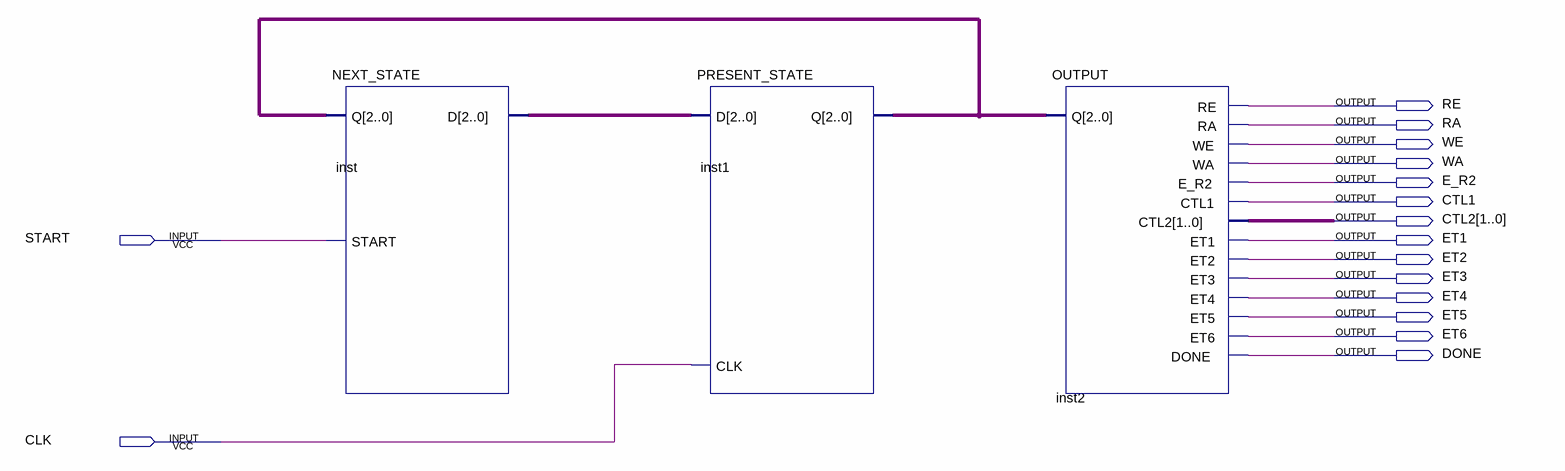
[diagram p0: schematic sheet]
// Quartus schematic Register_Merging_CONTROLLER.bdf as structural Verilog: 3 symbols, 16 pins
module Register_Merging_CONTROLLER (
  input  START,
  input  CLK,
  output RE,
  output RA,
  output WE,
  output WA,
  output E_R2,
  output CTL1,
  output [1:0] CTL2,
  output ET1,
  output ET2,
  output ET3,
  output ET4,
  output ET5,
  output ET6,
  output DONE
);

  wire [2:0] inst1_q, inst_d;

  NEXT_STATE inst (.START(START), .Q(inst1_q), .D(inst_d));
  PRESENT_STATE inst1 (.CLK(CLK), .D(inst_d), .Q(inst1_q));
  OUTPUT inst2 (
    .Q(inst1_q), .RE(RE), .RA(RA), .WE(WE), .WA(WA), .E_R2(E_R2), .CTL1(CTL1), .CTL2(CTL2), .ET1(ET1),
    .ET2(ET2), .ET3(ET3), .ET4(ET4), .ET5(ET5), .ET6(ET6), .DONE(DONE));
endmodule
